# Altium schematic sheet Schematic of PCB.SchDoc
size A4; SheetNumber: 1; SheetTotal: 2
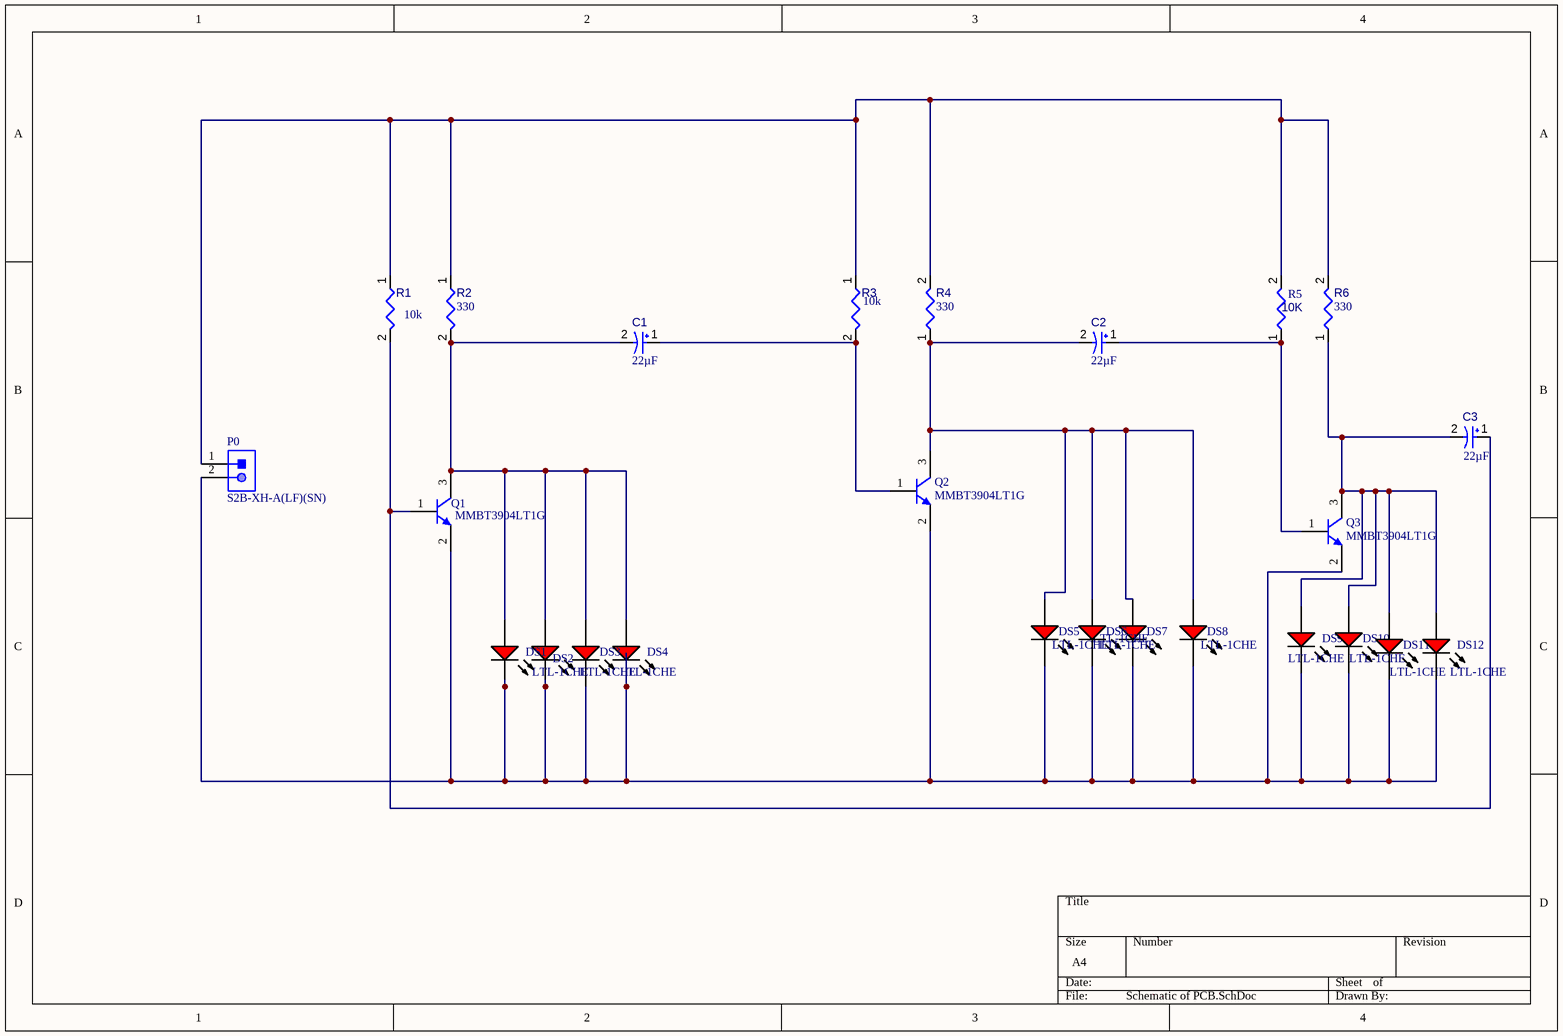
[diagram p0: Schematic of PCB.SchDoc]

## Parts
10K  value R5  [RESA60-630X240]  (hidden comment: MFR-25FBF52-10K)
C1  value 22µF  [CAPPR55-200-1100X500X1200]  (hidden comment: ECA1HM220)
C2  value 22µF  [CAPPR55-200-1100X500X1200]  (hidden comment: ECA1HM220)
C3  value 22µF  [CAPPR55-200-1100X500X1200]  (hidden comment: ECA1HM220)
DS1  (no value)  [INDPR60-254-520X380X650]
DS2  LTL-1CHE  [INDPR60-254-520X380X650]
DS3  LTL-1CHE  [INDPR60-254-520X380X650]
DS4  LTL-1CHE  [INDPR60-254-520X380X650]
DS5  LTL-1CHE  [INDPR60-254-520X380X650]
DS6  LTL-1CHE  [INDPR60-254-520X380X650]
DS7  LTL-1CHE  [INDPR60-254-520X380X650]
DS8  LTL-1CHE  [INDPR60-254-520X380X650]
DS9  LTL-1CHE  [INDPR60-254-520X380X650]
DS10  LTL-1CHE  [INDPR60-254-520X380X650]
DS11  LTL-1CHE  [INDPR60-254-520X380X650]
DS12  LTL-1CHE  [INDPR60-254-520X380X650]
P0  S2B-XH-A(LF)(SN)  [JST-S2B-XH-A(LF)(SN)_V]
Q1  MMBT3904LT1G  [ONSC-SOT-23-3-318-08_V]
Q2  MMBT3904LT1G  [ONSC-SOT-23-3-318-08_V]
Q3  MMBT3904LT1G  [ONSC-SOT-23-3-318-08_V]
R1  value 10k  [RESA60-630X240]  (hidden comment: MFR-25FBF52-10K)
R2  value 330  [RESC0402(1005)_L]  (hidden comment: Resistor 330R +/-5 % 0402 63 mW)
R3  value 10k  [RESA60-630X240]  (hidden comment: MFR-25FBF52-10K)
R4  value 330  [RESA60-630X240]  (hidden comment: MFR-25FBF52-10K)
R6  value 330  [RESA60-630X240]  (hidden comment: MFR-25FBF52-10K)

## Nets
Net10K_1: 10K.1 C2.1 Q3.1(B)
Net10K_2: 10K.2 P0.1 R1.1 R2.1 R3.1 R4.2 R6.2
NetC1_1: C1.1 Q2.1(B) R3.2
NetC1_2: C1.2 DS1.1(A) DS2.1(A) DS3.1(A) DS4.1(A) Q1.3(C) R2.2
NetC2_2: C2.2 DS5.1(A) DS6.1(A) DS7.1(A) DS8.1(A) Q2.3(C) R4.1
NetC3_1: C3.1 Q1.1(B) R1.2
NetC3_2: C3.2 DS9.1(A) DS10.1(A) DS11.1(A) DS12.1(A) Q3.3(C) R6.1
NetDS1_2: DS1.2(K) DS2.2(K) DS3.2(K) DS4.2(K) DS5.2(K) DS6.2(K) DS7.2(K) DS8.2(K) DS9.2(K) DS10.2(K) DS11.2(K) DS12.2(K) P0.2 Q1.2(E) Q2.2(E) Q3.2(E)

## Library data of the parts
10K R1 R3 R4 R6 = CMP-009-00047-4: Axial Resistor, 10 KOhm, +/- 1%, 0.25 W, -55 to 155 degC, 2-Pin THD, RoHS, Bulk; Manufacturer: Yageo; Power: 250mW; Voltage Rating: 250V; Manufacturer URL: http://www.yageo.com/; Datasheet URL: http://www.yageo.com/documents/recent/Yageo%20LR_MFR_2013.pdf; Package Reference: MFR-25; Min Operating Temperature: -55°C; Mounting Technology: TH; Package Quantity: 200; Case/Package: Axial; Tolerance: 1%; RoHS Compliant: True; Datasheet Version: Apr-13; Packaging: Bulk; Max Operating Temperature: 155°C; Package Description: 2-Pin Axial Lead, Dia 2.4 mm, Body Length 6.3 mm
C1-C3 = CMP-001-00027-7: Aluminum Electrolytic Capacitor, 22 uF, +/- 20%, 50 V, -40 to 85 degC, 2-Pin THD, RoHS, Bulk; Manufacturer: Panasonic; Ripple Current (AC): 100mA; Voltage Rating: 50V; Pins: 2; Case/Package: Radial; Datasheet Version: Rev. 05, 10/2016; RoHS Compliant: True; Max Operating Temperature: 85°C; Ripple Current: 100mA; Capacitor Type: Electrolytic; Mounting Technology: TH; Package Quantity: 200; Package Reference: CAPPR55-200-1100X500X1200; Package Description: 2-Pin Radial Lead, Dia 5 mm, Height 12 mm; Packaging: Bulk; Lead Pitch: 2mm; Min Operating Temperature: -40°C; Diameter: 5mm; Tolerance: 20%; Datasheet URL: https://industrial.panasonic.com/cdbs/www-data/pdf/RDF0000/ABA0000C1218.pdf; Manufacturer URL: http://www.panasonic.com/
DS1-DS12 = CMP-007-00018-2: LED Uni-Color Red, 100 mW, 30 mA, -55 to 100 degC, 2-Pin THD, RoHS, Bulk; Manufacturer: Lite-On; Forward Current: 20mA; Nominal Vf: 2V; Viewing Angle: 60degrees; Luminous Intensity: 12.6mcd; Lens Style: Dome; Pins: 2; RoHS Compliant: True; Package Reference: LTL-1CHE; Package Quantity: 1000; Mounting Technology: TH; Min Operating Temperature: -55°C; Colour: Red; Case/Package: Radial; Manufacturer URL: http://www.us.liteon.com/; Datasheet URL: https://datasheet.ciiva.com/15117/getdatasheetpartid-187746-15117985.pdf; Forward Voltage: 2V; Max Operating Temperature: 100°C; Illumination Colour: Red; Package Description: 2-Pin Through Hole Device, Dia 3.8 mm, Pitch 2.54 mm; Packaging: Bulk; Datasheet Version: Dec-03
P0 = CMP-002-00032-2: Male Header, Pitch 2.5 mm, 1 x 2 Position, Height 6.1 mm, Tail Length 3.4 mm, -25 to 85 degC, RoHS, Bulk; Manufacturer: JST; Case/Package: S2B-XH-A(LF)(SN); Package Description: XH Series Disconnectable Crimp Style Connector, Pitch 2.5 mm, 1 x 2 Position, Height 6.1 mm, Tail Length 3.4 mm; Manufacturer URL: http://www.jst.com/home2.html; Datasheet URL: http://www.jst-mfg.com/product/pdf/eng/eXH.pdf; Connector Type: Header; Package Reference: S2B-XH-A(LF)(SN); Mounting Technology: TH; Max Operating Temperature: 85°C; Min Operating Temperature: -25°C; Datasheet Version: May-16; Gender: Male; RoHS Compliant: Unknown
Q1-Q3 = CMP-013-00007-3: General Purpose Transistor, NPN Silicon, 40 V, 0.2 A, -55 to 150 degC, 3-Pin SOT23, RoHS, Tape and Reel; Manufacturer: ON Semiconductor; Elements: 1; Power: 225mW; Frequency: 300MHz; hFE Min: 80; Vce Max: 300mV; Mounting Technology: SM; Min Operating Temperature: -55°C; Datasheet URL: http://www.onsemi.cn/pub_link/Collateral/MMBT3904LT1-D.PDF; Pins: 3; Package Description: 3-Pin Small Outline Transistor, Body 2.9 x 1.3 mm, Pitch 0.95 mm; Max Operating Temperature: 150°C; Package Reference: SOT-23 (318-08); Package Quantity: 3000; RoHS Compliant: True; Packaging: TapeandReel; Datasheet Version: Rev. 12, 11/2012; Case/Package: TO-236-3
R2 = CMP-009-00132-3: Chip Resistor, 330 Ohms, +/-5 %, 63 mW, -55 to 155 degC, 0402; Power: 63mW; Tolerance: 5%; Pins: 2; Max Operating Temperature: 155°C; Min Operating Temperature: -55°C; Case/Package: 0402